# Altium schematic sheet Test.SCHDOC
size A4
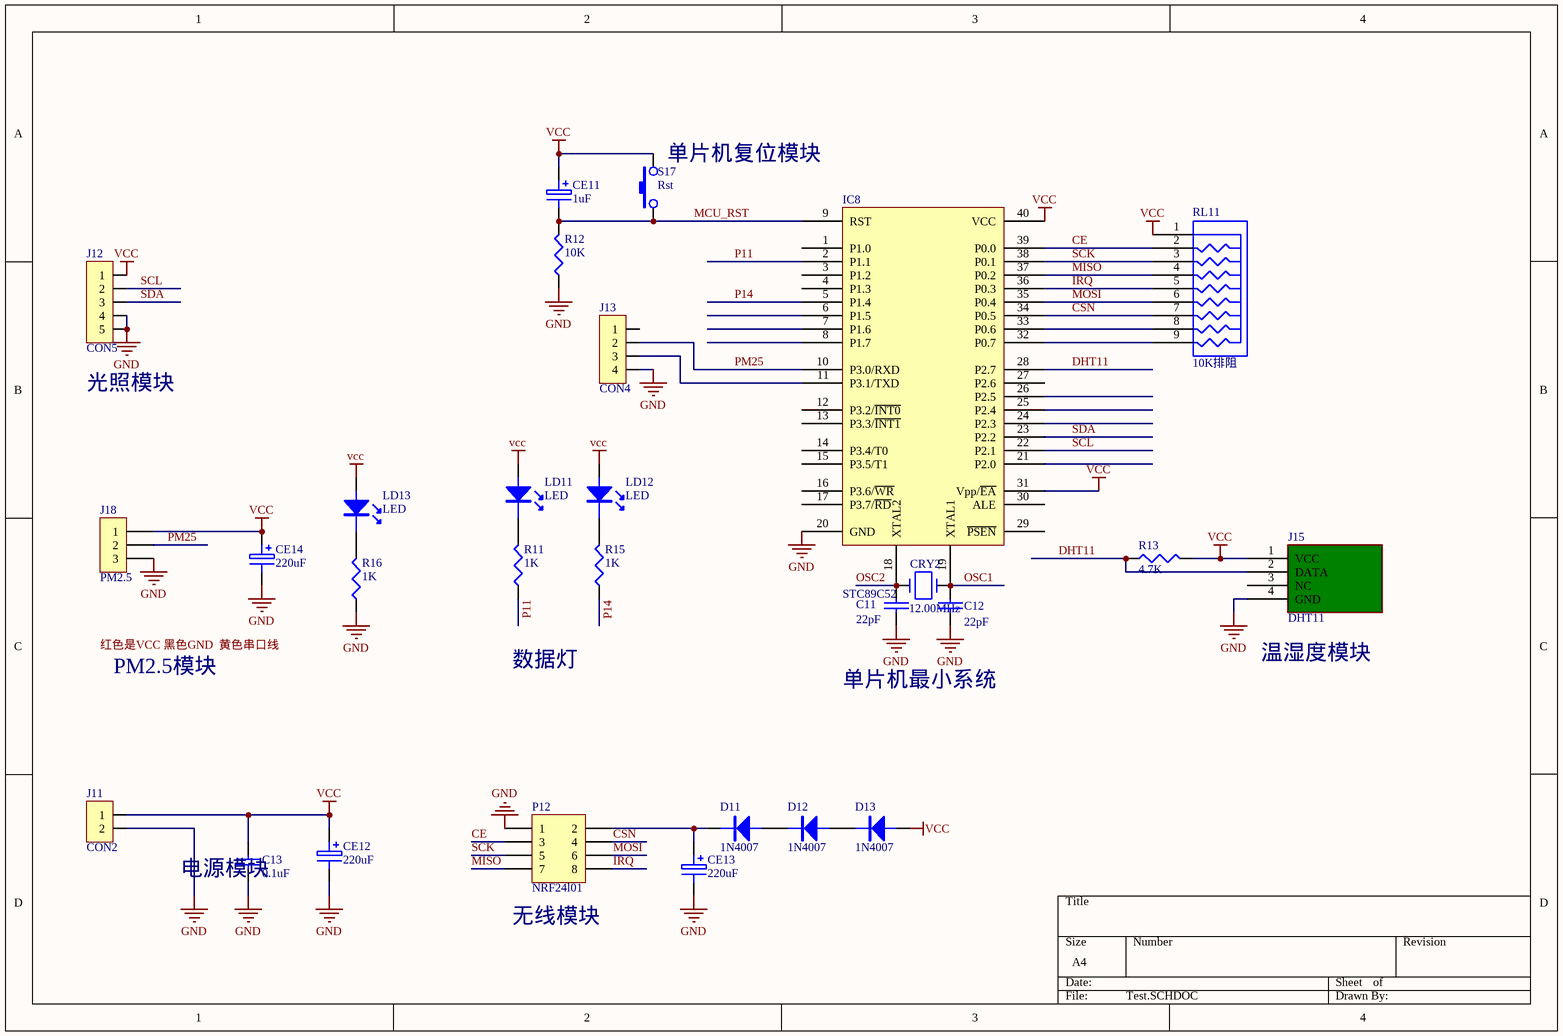
[diagram p0: Test.SCHDOC]

## Parts
C11  22pF  [RAD0.1]
C12  22pF  [RAD0.1]
C13  0.1uF  [RAD0.1]
CE11  1uF  [RB.1/.1]
CE12  220uF  [RB.1/.2]
CE13  220uF  [RB.1/.2]
CE14  220uF  [RB.1/.2]
CRY2  12.00MHz  [XTAL1]
D11  1N4007  [DIODE0.3]
D12  1N4007  [DIODE0.3]
D13  1N4007  [DIODE0.3]
IC8  STC89C52  [DIP40]
J11  CON2  [HJ2P2.54]
J12  CON5  [SIP5]
J13  CON4  [SIP4]
J15  DHT11  [HJ4P2.54]
J18  PM2.5  [SIP3]
LD11  LED  [LED3F-R]
LD12  LED  [LED3F-R]
LD13  LED  [LED3F-R]
P12  NRF24l01  [HDR2.54-2X4]
R11  1K  [AXIAL0.3]
R12  10K  [AXIAL0.3]
R13  4.7K  [AXIAL0.3]
R15  1K  [AXIAL0.3]
R16  1K  [AXIAL0.3]
RL11  10K排阻  [RES9P]
S17  Rst  [SW-PB4DS]

## Nets
GND: C11.2 C12.2 C13.2 CE12.2 CE13.2 CE14.2 IC8.20(GND) J11.2 J12.4 J12.5 J13.4 J15.4(GND) J18.3 P12.1 R12.1 R16.1
vcc: C13.1 CE11.1 CE12.1 CE14.1 D13.A IC8.31(Vpp/~{EA}) IC8.40(VCC) J11.1 J12.1 J15.1(VCC) J18.1 LD11.A LD12.A LD13.A R13.2 RL11.1 S17.1
CE: IC8.39(P0.0) P12.3 RL11.2
CSN: IC8.34(P0.5) P12.4 RL11.7
DHT11: IC8.28(P2.7) J15.2(DATA) R13.1
IRQ: IC8.36(P0.3) P12.8 RL11.5
MCU_RST: CE11.2 IC8.9(RST) R12.2 S17.2
MISO: IC8.37(P0.2) P12.7 RL11.4
MOSI: IC8.35(P0.4) P12.6 RL11.6
OSC1: C12.1 CRY2.2 IC8.19(XTAL1)
OSC2: C11.1 CRY2.1 IC8.18(XTAL2)
P11: IC8.2(P1.1) R11.1
P14: IC8.5(P1.4) R15.1
PM25: IC8.10(P3.0/RXD) J13.2 J18.2
SCK: IC8.38(P0.1) P12.5 RL11.3
SCL: IC8.22(P2.1) J12.2
SDA: IC8.23(P2.2) J12.3
NetCE13_1: CE13.1 D11.K P12.2
NetD11_A: D11.A D12.K
NetD12_A: D12.A D13.K
NetIC8_11: IC8.11(P3.1/TXD) J13.3
NetIC8_32: IC8.32(P0.7) RL11.9
NetIC8_33: IC8.33(P0.6) RL11.8
NetLD11_K: LD11.K R11.2
NetLD12_K: LD12.K R15.2
NetLD13_K: LD13.K R16.2

Not connected (* = marked no-connect by the designer): IC8 1(P1.0) 3(P1.2) 4(P1.3) 6(P1.5) 7(P1.6) 8(P1.7) 12(P3.2/~{INT0}) 13(P3.3/~{INT1}) 14(P3.4/T0) 15(P3.5/T1) 16(P3.6/~{WR}) 17(P3.7/~{RD}) 21(P2.0) 24(P2.3) 25(P2.4) 26(P2.5) 27(P2.6) 29(~{PSEN}) 30(ALE); J13 1; J15 3(NC)

## Notes on the sheet
- (near S17) 单片机复位模块
- (near J12) 光照模块
- PM2.5模块
- 数据灯
- 单片机最小系统
- (near J15) 温湿度模块
- (near J11) 电源模块
- (near P12) 无线模块
- Labels drawn without touching a wire or pin: 红色是VCC 黑色GND  黄色串口线

## Library data of the parts
C11 C12 = CAP: Capacitor
C13 = CAP
CE11-CE14 = ELECTRO1
CRY2 = CRYSTAL
D11-D13 = DIODE
IC8 = AT89C51
J15 = CON4
J18 = CON3: Connector
P12 = Header 4X2: Header, 4-Pin, Dual row; LatestRevisionDate: 17-Jul-2002; LatestRevisionNote: Re-released for DXP Platform.; Publisher: Altium Limited
R11-R13 R15 R16 = RES1
RL11 = RESL1
S17 = SW-PB